# Altium schematic sheet MCU.SchDoc
size A3
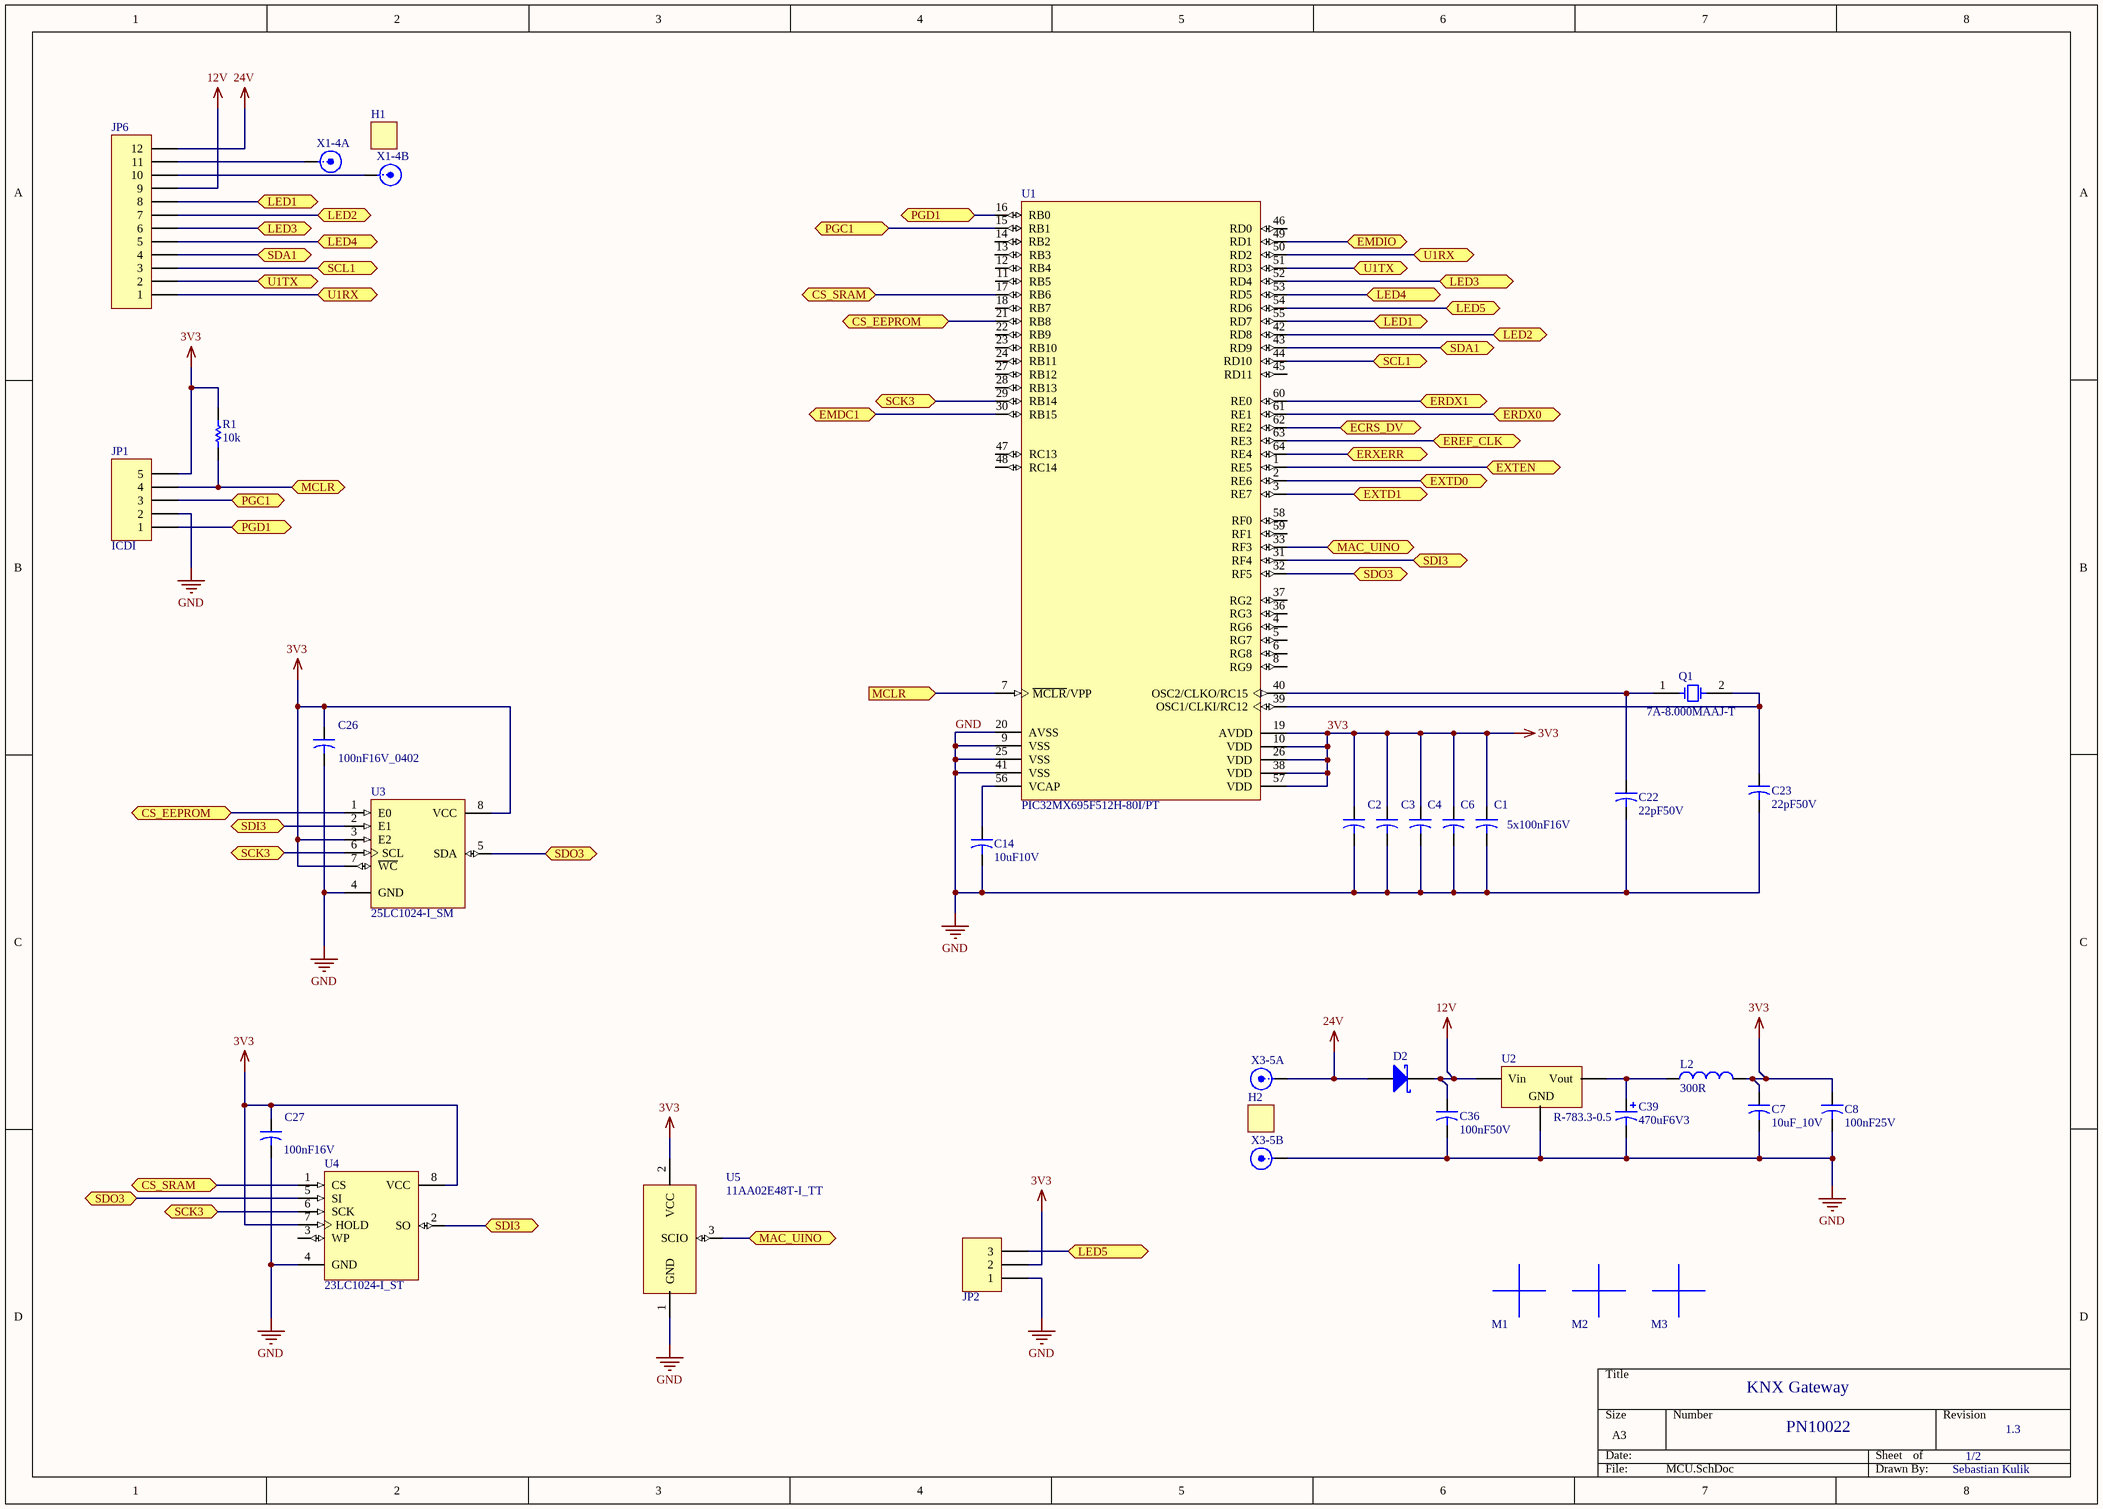
[diagram p0: MCU.SchDoc]

## Parts
C1  100nF16V_0402  [C0402]  (value not drawn)
C2  100nF16V_0402  [C0402]  (value not drawn)
C3  100nF16V_0402  [C0402]  (value not drawn)
C4  100nF16V_0402  [C0402]  (value not drawn)
C6  100nF16V_0402  [C0402]  (value not drawn)
C7  value 10uF_10V  [C0603]  (hidden comment: 10uF10V_0603)
C8  value 100nF25V  [C0402]  (hidden comment: 100nF25V_0402)
C14  value 10uF10V  [C0603]  (hidden comment: 10uF10V_0603)
C22  value 22pF50V  [C0402]  (hidden comment: 22pF50V_0402-AVX)
C23  value 22pF50V  [C0402]  (hidden comment: 22pF50V_0402-AVX)
C26  100nF16V_0402  [C0402]
C27  value 100nF16V  [C0402]  (hidden comment: 100nF16V_0402)
C36  value 100nF50V  [C0402]  (hidden comment: 100n50V_0402)
C39  value 470uF6V3  [Panasonic_TPE-D4]  (hidden comment: 470uF_6V3_TPE-4D)
D2  RB160M-30TR  [SOD123]  (value not drawn)
H1  Wago-243-211  [WAGO-243-211]  (value not drawn)
H2  Wago-243-211  [WAGO-243-211]  (value not drawn)
JP1  ICDI  [HDR1X5-1.27]
JP2  Header-3  [HDR1X3]  (value not drawn)
JP6  Plug_12_2.54  [HDR1X12_2.54]  (value not drawn)
L2  value 300R  [L0603]  (hidden comment: 300R2A_0603)
M1  Paste-Mark  [Mark-3mm]  (value not drawn)
M2  Paste-Mark  [Mark-3mm]  (value not drawn)
M3  Paste-Mark  [Mark-3mm]  (value not drawn)
Q1  7A-8.000MAAJ-T  [TXC_7A]
R1  value 10k  [R0402]  (hidden comment: 10k_0402)
U1  PIC32MX695F512H-80I/PT  [TQFP-64_N1]
U2  R-783.3-0.5  [R-783_3-0_5]
U3  25LC1024-I_SM  [SOP8_N]
U4  23LC1024-I_ST  [TSSOP8]
U5  11AA02E48T-I_TT  [SOT23_M]
X1-4  Wago-243-131  [WAGO-243-131]  (value not drawn)  (parts A,B of 2)
X3-5  Wago-243-131  [WAGO-243-131]  (value not drawn)  (parts A,B of 2)

## Ports
CS_EEPROM, CS_SRAM, ECRS_DV, EMDC1, EMDIO, ERDX0, ERDX1, EREF_CLK, ERXERR, EXTD0, EXTD1, EXTEN, LED1, LED2, LED3, LED4, LED5, MAC_UINO, MCLR, MCLR (in), PGC1, PGD1, SCK3, SCL1, SDA1, SDI3, SDO3, U1RX, U1TX

## Nets
3V3: C1.1 C2.1 C3.1 C4.1 C6.1 C7.1 C8.1 C26.1 C27.1 JP1.5 JP2.2 L2.2 R1.2 U1.10(VDD) U1.19(AVDD) U1.26(VDD) U1.38(VDD) U1.57(VDD) U3.3(E2) U3.7(~{WC}) U3.8(VCC) U4.7(HOLD) U4.8(VCC) U5.2(VCC)
12V: C36.1 D2.1(K) JP6.9 U2.1(Vin)
24V: D2.2(A) JP6.12 X3-5.1(X)
GND: C1.2 C2.2 C3.2 C4.2 C6.2 C7.2 C8.2 C14.2 C22.2 C23.2 C26.2 C27.2 C36.2 C39.2 JP1.2 JP2.1 U1.9(VSS) U1.20(AVSS) U1.25(VSS) U1.41(VSS) U2.2(GND) U3.4(GND) U4.4(GND) U5.1(GND) X3-5.2(Y)
CS_EEPROM: U1.21(RB8) U3.1(E0) ; port CS_EEPROM
CS_SRAM: U1.17(RB6) U4.1(CS) ; port CS_SRAM
ECRS_DV: U1.62(RE2) ; port ECRS_DV
EMDC1: U1.30(RB15) ; port EMDC1
EMDIO: U1.49(RD1) ; port EMDIO
ERDX0: U1.61(RE1) ; port ERDX0
ERDX1: U1.60(RE0) ; port ERDX1
EREF_CLK: U1.63(RE3) ; port EREF_CLK
ERXERR: U1.64(RE4) ; port ERXERR
EXTD0: U1.2(RE6) ; port EXTD0
EXTD1: U1.3(RE7) ; port EXTD1
EXTEN: U1.1(RE5) ; port EXTEN
LED1: JP6.8 U1.55(RD7) ; port LED1
LED2: JP6.7 U1.42(RD8) ; port LED2
LED3: JP6.6 U1.52(RD4) ; port LED3
LED4: JP6.5 U1.53(RD5) ; port LED4
LED5: JP2.3 U1.54(RD6) ; port LED5
MAC_UINO: U1.33(RF3) U5.3(SCIO) ; port MAC_UINO
MCLR: JP1.4 R1.1 U1.7(~{MCLR}/VPP) ; port MCLR
PGC1: JP1.3 U1.15(RB1) ; port PGC1
PGD1: JP1.1 U1.16(RB0) ; port PGD1
SCK3: U1.29(RB14) U3.6(SCL) U4.6(SCK) ; port SCK3
SCL1: JP6.3 U1.44(RD10) ; port SCL1
SDA1: JP6.4 U1.43(RD9) ; port SDA1
SDI3: U1.31(RF4) U3.2(E1) U4.2(SO) ; port SDI3
SDO3: U1.32(RF5) U3.5(SDA) U4.5(SI) ; port SDO3
U1RX: JP6.1 U1.50(RD2) ; port U1RX
U1TX: JP6.2 U1.51(RD3) ; port U1TX
NetC14_1: C14.1 U1.56(VCAP)
NetC22_1: C22.1 Q1.1(E/D) U1.40(OSC2/CLKO/RC15)
NetC23_1: C23.1 Q1.2(GND) U1.39(OSC1/CLKI/RC12)
NetC39_1: C39.1 L2.1 U2.3(Vout)
NetJP6_10: JP6.10 X1-4.2(Y)
NetJP6_11: JP6.11 X1-4.1(X)

Not connected (* = marked no-connect by the designer): U1 4(RG6) 5(RG7) 6(RG8) 8(RG9) 11(RB5) 12(RB4) 13(RB3) 14(RB2) 18(RB7) 22(RB9) 23(RB10) 24(RB11) 27(RB12) 28(RB13) 36(RG3) 37(RG2) 45(RD11) 46(RD0) 47(RC13) 48(RC14) 58(RF0) 59(RF1); U4 3(WP)

## Notes on the sheet
- (near C1) 5x100nF16V
- KNX Gateway
- PN10022
- 1/2
- 1.3
- Sebastian Kulik

## Library data of the parts
C1-C4 C6 C26 C27 = 100nF16V_0402: Capacitor; Part Description: TDK. CGA series, X7R, 10%, 16V; Deliverer PartNr: 2210748RL; Manufacturer: TDK; Manufacturer PartNr: CGA2B1X7R1C104K050BC; Deliverer: Farnell; TDFE-PN: C0025; Published: 12.02.2014; Publisher: Sebastian Kulik; PackageDescription: C0403
  C1-C4 C6 C26: Value: 100nF16V
C7 = 10uF10V_0603: AVX ,  X5R, 20%, 10V; Deliverer PartNr: 1867954RL; Manufacturer PartNr: 0603ZD106MAT2A; Deliverer: Farnell; TDFE-PN: C0016; Published: 11.02.2014; Part Description: AVX ,  X5R, 20%, 10V; Publisher: Sebastian Kulik; PackageDescription: C0603; Manufacturer: AVX
C8 = 100nF25V_0402: AVX, X5R, 10%, 25V; Deliverer PartNr: 2280767; Manufacturer PartNr: 04023D104KAT2A; Deliverer: Farnell; TDFE-PN: C0036; Published: 13.02.2014; Part Description: AVX, X5R, 10%, 25V; Publisher: Sebastian Kulik; PackageDescription: C0403; Manufacturer: AVX
C14 = 10uF10V_0603: Capacitor; Part Description: AVX ,  X5R, 20%, 10V; Deliverer PartNr: 1867954RL; Manufacturer: AVX; Manufacturer PartNr: 0603ZD106MAT2A; Deliverer: Farnell; TDFE-PN: C0016; Published: 11.02.2014; Publisher: Sebastian Kulik; PackageDescription: C0603
C22 C23 = 22pF50V_0402-AVX: AVX, 50V; Deliverer PartNr: 2332500; Manufacturer PartNr: 04025A220FAT2A; Deliverer: Farnell; TDE-PN: C0021; Published: 22.10.2014; Part Description: AVX, 50V; Publisher: Sebastian Kulik; PackageDescription: C0402; Manufacturer: AVX
C36 = 100n50V_0402: C series, X5R, 10%, 50V; Deliverer PartNr: 2354078; Manufacturer: TDK; Manufacturer PartNr: C1005X5R1H104K050BB; Deliverer: Farnell; TDFE-PN: C0044; Published: 13.02.2014; Part Description: C series, X5R, 10%, 50V; Publisher: Sebastian Kulik; PackageDescription: C0403
C39 = 470uF_6V3_TPE-4D: TPE-4D series, tantal, 10%, 6.3V; Deliverer PartNr: 2354921; Manufacturer: Panasonic; Manufacturer PartNr: 6TPE470MI; Deliverer: Farnell; TDE-PN: C0063; Published: 18.03.2015; Part Description: TPE-4D series, tantal, 10%, 6.3V; Publisher: Sebastian Kulik; PackageDescription: Panasonic, TPE-D4
D2 = RB160M-30TR: Diode Schottky,2A,40V; Deliverer PartNr: 1525480; Manufacturer: Rohm; TDE-PN: DIS0010; Deliverer: Farnell; Published: 17.02.2014; Publisher: Sebastian Kulik; PackageDescription: SOD123; Manufacturer PartNr: RB160M-30TR
H1 H2 = Wago-243-211: Manufacturer: Wago; TDE-PN: CON0021; LatestRevisionDate: 01.07.2014; LatestRevisionNote: Re-released for DXP Platform.; Publisher: Sebastian Kulik; Manufacturer PartNr: 243-211; Deliverer: *; Deliverer PartNr: *
JP1 = ICDI: Header, 5-Pin; LatestRevisionDate: 17-Jul-2002; LatestRevisionNote: Re-released for DXP Platform.; Publisher: Sebastian Kulik
JP2 = Header-3: Header-3-Pin; Publisher: Sebastian Kulik
JP6 = Plug_12_2.54: Plug, 11-Pin; Manufacturer PartNr: 61301211121; Manufacturer: WE; TDE-PN: CON0018; LatestRevisionDate: 27.05.2014; LatestRevisionNote: Re-released for DXP Platform.; Publisher: Sebastian Kulik; Deliverer: WE; Deliverer PartNr: 61301211121
L2 = 300R2A_0603: WE, Ferrit, 300Rx2A; Deliverer PartNr: 1635705; Manufacturer PartNr: 742792641; Deliverer: Farnell; TDE-PN: P0021; Manufacturer: WE; Published: 26.05.2014; Publisher: Sebastian Kulik
M1-M3 = Mark
Q1 = Crystal_8MHz: Crystal, 7A-8.000MAAJ-T; Deliverer PartNr: 1892148; Manufacturer: TXC; Deliverer: Farnell; TDE-PN: P0003; Published: 14.02.2014; PackageReference: 7A; Publisher: Sebastian Kulik; Manufacturer PartNr: 7A-8.000MAAJ-T
R1 = 10k_0402: Vishay CRCW series, 125mW, 1%; Manufacturer PartNr: CRCW040210K0FKEAHP; Deliverer PartNr: 1738864; TDE-PN: R0012; Deliverer: Farnell; Published: 12.02.2014; PackageReference: 0402; Publisher: Sebastian Kulik; PackageDescription: 0402; Manufacturer: Vishay; Part Description: Vishay CRCW series, 125mW, 1%
U1 = PIC32MX695F512H-80I/PT: High Performance ROM-less Microcontroller with External Memory Bus, 1.5K RAM, 64-Pin TQFP, 4.2 to 5.5V Supply Range, Industrial Temperature; Deliverer PartNr: 1778975; Manufacturer: Microchip; Deliverer: Farnell; TDE-PN: IC0031; Published: 11.02.2014; PackageReference: TQFP-64; Publisher: Sebastian Kulik; PackageDescription: 64-Pin Thin Plastic Quad Flat Pack 0.5 mm Pitch, 1.0/0.1 mm Lead Form; Manufacturer PartNr: PIC32MX695F512H-80I/PT
U2 = Recom-R-783_3-0_5: Voltage Regulator; Manufacturer: Recom; TDE-PN: IC0032; Published: 12.02.2014; Manufacturer PartNr: R-783.3-0.5; PackageReference: D2PAK; Publisher: Sebastian Kulik
U3 = 25LC1024-I_SM: 1024 Kbit Serial SPI Bus EEPROM; Deliverer PartNr: 1331393; Manufacturer: Microchip; Deliverer: Farnell; TDE-PN: IC0033; Published: 12.02.2014; PackageReference: SOP8; Publisher: Sebastian Kulik; Manufacturer PartNr: 25LC1024-I_SM
U4 = 23LC1024-I_ST: 1 Mbit Serial  EEPROM; Deliverer PartNr: 2212151; Manufacturer PartNr: 23LC1024-I/ST; Manufacturer: Microchip; Deliverer: Farnell; TDE-PN: IC0034; Published: 12.02.2014; PackageReference: TSSOP8; Publisher: Sebastian Kulik
U5 = 11AA02E48T-I_TT: 2 kbit Serial  EEPROM; Deliverer PartNr: 1707616RL; Manufacturer PartNr: 11AA02E48T-I/TT; Manufacturer: Microchip; Deliverer: Farnell; TDE-PN: IC0035; Published: 12.02.2014; PackageReference: SOT23; Publisher: Sebastian Kulik
X1-4 X3-5 = Wago-243-131: Manufacturer: Wago; TDE-PN: CON0020; LatestRevisionDate: 01.07.2014; LatestRevisionNote: Re-released for DXP Platform.; Publisher: Sebastian Kulik; Manufacturer PartNr: 243-131; Deliverer: *; Deliverer PartNr: *